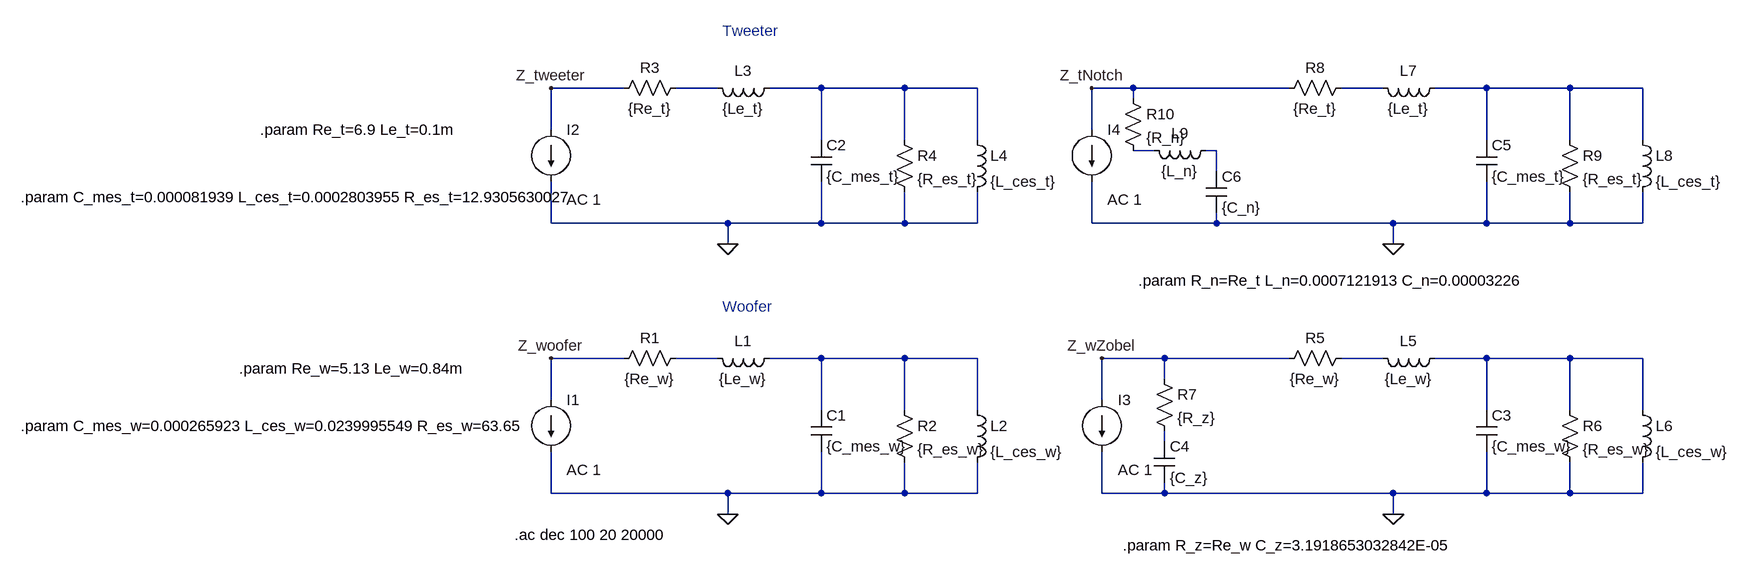
[diagram p0: schematic FreeSpace.asc]
FreeSpace.asc, the LTspice schematic file:
Version 4
SHEET 1 1732 680
WIRE 16 -288 -96 -288
WIRE 160 -288 96 -288
WIRE 320 -288 240 -288
WIRE 448 -288 320 -288
WIRE 560 -288 448 -288
WIRE 800 -288 736 -288
WIRE 1040 -288 800 -288
WIRE 1184 -288 1120 -288
WIRE 1344 -288 1264 -288
WIRE 1472 -288 1344 -288
WIRE 1584 -288 1472 -288
WIRE 800 -272 800 -288
WIRE -96 -224 -96 -288
WIRE 736 -224 736 -288
WIRE 320 -208 320 -288
WIRE 448 -208 448 -288
WIRE 560 -208 560 -288
WIRE 1344 -208 1344 -288
WIRE 1472 -208 1472 -288
WIRE 1584 -208 1584 -288
WIRE 832 -192 800 -192
WIRE 928 -192 912 -192
WIRE 928 -160 928 -192
WIRE -96 -80 -96 -144
WIRE 176 -80 -96 -80
WIRE 320 -80 320 -144
WIRE 320 -80 176 -80
WIRE 448 -80 448 -128
WIRE 448 -80 320 -80
WIRE 560 -80 560 -128
WIRE 560 -80 448 -80
WIRE 736 -80 736 -144
WIRE 928 -80 928 -96
WIRE 928 -80 736 -80
WIRE 1200 -80 928 -80
WIRE 1344 -80 1344 -144
WIRE 1344 -80 1200 -80
WIRE 1472 -80 1472 -128
WIRE 1472 -80 1344 -80
WIRE 1584 -80 1584 -128
WIRE 1584 -80 1472 -80
WIRE 176 -48 176 -80
WIRE 1200 -48 1200 -80
WIRE 16 128 -96 128
WIRE 160 128 96 128
WIRE 320 128 240 128
WIRE 448 128 320 128
WIRE 560 128 448 128
WIRE 848 128 752 128
WIRE 1040 128 848 128
WIRE 1184 128 1120 128
WIRE 1344 128 1264 128
WIRE 1472 128 1344 128
WIRE 1584 128 1472 128
WIRE 848 160 848 128
WIRE -96 192 -96 128
WIRE 752 192 752 128
WIRE 320 208 320 128
WIRE 448 208 448 128
WIRE 560 208 560 128
WIRE 1344 208 1344 128
WIRE 1472 208 1472 128
WIRE 1584 208 1584 128
WIRE 848 256 848 240
WIRE -96 336 -96 272
WIRE 176 336 -96 336
WIRE 320 336 320 272
WIRE 320 336 176 336
WIRE 448 336 448 288
WIRE 448 336 320 336
WIRE 560 336 560 288
WIRE 560 336 448 336
WIRE 752 336 752 272
WIRE 848 336 848 320
WIRE 848 336 752 336
WIRE 1200 336 848 336
WIRE 1344 336 1344 272
WIRE 1344 336 1200 336
WIRE 1472 336 1472 288
WIRE 1472 336 1344 336
WIRE 1584 336 1584 288
WIRE 1584 336 1472 336
WIRE 176 368 176 336
WIRE 1200 368 1200 336
FLAG 176 368 0
FLAG -96 128 Z_woofer
FLAG 176 -48 0
FLAG -96 -288 Z_tweeter
FLAG 1200 368 0
FLAG 752 128 Z_wZobel
FLAG 1200 -48 0
FLAG 736 -288 Z_tNotch
SYMBOL ind 256 112 R90
WINDOW 0 5 56 VBottom 2
WINDOW 3 32 56 VTop 2
SYMATTR InstName L1
SYMATTR Value {Le_w}
SYMBOL res 112 112 R90
WINDOW 0 0 56 VBottom 2
WINDOW 3 32 56 VTop 2
SYMATTR InstName R1
SYMATTR Value {Re_w}
SYMBOL current -96 192 R0
WINDOW 123 24 108 Left 2
WINDOW 39 0 0 Left 2
SYMATTR Value2 AC 1
SYMATTR InstName I1
SYMATTR Value ""
SYMBOL cap 304 208 R0
SYMATTR InstName C1
SYMATTR Value {C_mes_w}
SYMBOL res 432 192 R0
SYMATTR InstName R2
SYMATTR Value {R_es_w}
SYMBOL ind 544 192 R0
SYMATTR InstName L2
SYMATTR Value {L_ces_w}
SYMBOL ind 256 -304 R90
WINDOW 0 5 56 VBottom 2
WINDOW 3 32 56 VTop 2
SYMATTR InstName L3
SYMATTR Value {Le_t}
SYMBOL res 112 -304 R90
WINDOW 0 0 56 VBottom 2
WINDOW 3 32 56 VTop 2
SYMATTR InstName R3
SYMATTR Value {Re_t}
SYMBOL current -96 -224 R0
WINDOW 123 24 108 Left 2
WINDOW 39 0 0 Left 2
SYMATTR Value2 AC 1
SYMATTR InstName I2
SYMATTR Value ""
SYMBOL cap 304 -208 R0
SYMATTR InstName C2
SYMATTR Value {C_mes_t}
SYMBOL res 432 -224 R0
SYMATTR InstName R4
SYMATTR Value {R_es_t}
SYMBOL ind 544 -224 R0
SYMATTR InstName L4
SYMATTR Value {L_ces_t}
SYMBOL ind 1280 112 R90
WINDOW 0 5 56 VBottom 2
WINDOW 3 32 56 VTop 2
SYMATTR InstName L5
SYMATTR Value {Le_w}
SYMBOL res 1136 112 R90
WINDOW 0 0 56 VBottom 2
WINDOW 3 32 56 VTop 2
SYMATTR InstName R5
SYMATTR Value {Re_w}
SYMBOL cap 1328 208 R0
SYMATTR InstName C3
SYMATTR Value {C_mes_w}
SYMBOL res 1456 192 R0
SYMATTR InstName R6
SYMATTR Value {R_es_w}
SYMBOL ind 1568 192 R0
SYMATTR InstName L6
SYMATTR Value {L_ces_w}
SYMBOL res 832 144 R0
SYMATTR InstName R7
SYMATTR Value {R_z}
SYMBOL cap 832 256 R0
SYMATTR InstName C4
SYMATTR Value {C_z}
SYMBOL current 752 192 R0
WINDOW 123 24 108 Left 2
WINDOW 39 0 0 Left 2
SYMATTR Value2 AC 1
SYMATTR InstName I3
SYMATTR Value ""
SYMBOL ind 1280 -304 R90
WINDOW 0 5 56 VBottom 2
WINDOW 3 32 56 VTop 2
SYMATTR InstName L7
SYMATTR Value {Le_t}
SYMBOL res 1136 -304 R90
WINDOW 0 0 56 VBottom 2
WINDOW 3 32 56 VTop 2
SYMATTR InstName R8
SYMATTR Value {Re_t}
SYMBOL cap 1328 -208 R0
SYMATTR InstName C5
SYMATTR Value {C_mes_t}
SYMBOL res 1456 -224 R0
SYMATTR InstName R9
SYMATTR Value {R_es_t}
SYMBOL ind 1568 -224 R0
SYMATTR InstName L8
SYMATTR Value {L_ces_t}
SYMBOL res 784 -288 R0
SYMATTR InstName R10
SYMATTR Value {R_n}
SYMBOL ind 928 -208 R90
WINDOW 0 5 56 VBottom 2
WINDOW 3 32 56 VTop 2
SYMATTR InstName L9
SYMATTR Value {L_n}
SYMBOL cap 912 -160 R0
SYMATTR InstName C6
SYMATTR Value {C_n}
SYMBOL current 736 -224 R0
WINDOW 123 24 108 Left 2
WINDOW 39 0 0 Left 2
SYMATTR Value2 AC 1
SYMATTR InstName I4
SYMATTR Value ""
TEXT -152 400 Left 2 !.ac dec 100 20 20000
TEXT -576 144 Left 2 !.param Re_w=5.13 Le_w=0.84m
TEXT -912 232 Left 2 !.param C_mes_w=0.000265923 L_ces_w=0.0239995549 R_es_w=63.65
TEXT -544 -224 Left 2 !.param Re_t=6.9 Le_t=0.1m
TEXT -912 -120 Left 2 !.param C_mes_t=0.000081939 L_ces_t=0.0002803955 R_es_t=12.9305630027
TEXT 168 -376 Left 2 ;Tweeter
TEXT 168 48 Left 2 ;Woofer
TEXT 784 416 Left 2 !.param R_z=Re_w C_z=3.1918653032842E-05
TEXT 808 8 Left 2 !.param R_n=Re_t L_n=0.0007121913 C_n=0.00003226

The netlist it stands for:
* FreeSpace.asc
L1 N008 N007 {Le_w}
R1 N007 Z_woofer {Re_w}
I1 Z_woofer 0 AC 1
C1 N008 0 {C_mes_w}
R2 N008 0 {R_es_w}
L2 N008 0 {L_ces_w}
L3 N002 N001 {Le_t}
R3 N001 Z_tweeter {Re_t}
I2 Z_tweeter 0 AC 1
C2 N002 0 {C_mes_t}
R4 N002 0 {R_es_t}
L4 N002 0 {L_ces_t}
L5 N010 N009 {Le_w}
R5 N009 Z_wZobel {Re_w}
C3 N010 0 {C_mes_w}
R6 N010 0 {R_es_w}
L6 N010 0 {L_ces_w}
R7 Z_wZobel N011 {R_z}
C4 N011 0 {C_z}
I3 Z_wZobel 0 AC 1
L7 N004 N003 {Le_t}
R8 N003 Z_tNotch {Re_t}
C5 N004 0 {C_mes_t}
R9 N004 0 {R_es_t}
L8 N004 0 {L_ces_t}
R10 Z_tNotch N005 {R_n}
L9 N006 N005 {L_n}
C6 N006 0 {C_n}
I4 Z_tNotch 0 AC 1
.ac dec 100 20 20000
.param Re_w=5.13 Le_w=0.84m
.param C_mes_w=0.000265923 L_ces_w=0.0239995549 R_es_w=63.65
.param Re_t=6.9 Le_t=0.1m
.param C_mes_t=0.000081939 L_ces_t=0.0002803955 R_es_t=12.9305630027
* Tweeter
* Woofer
.param R_z=Re_w C_z=3.1918653032842E-05
.param R_n=Re_t L_n=0.0007121913 C_n=0.00003226
.backanno
.end

* Results of the author's LTspice run, read from the files saved beside the schematic
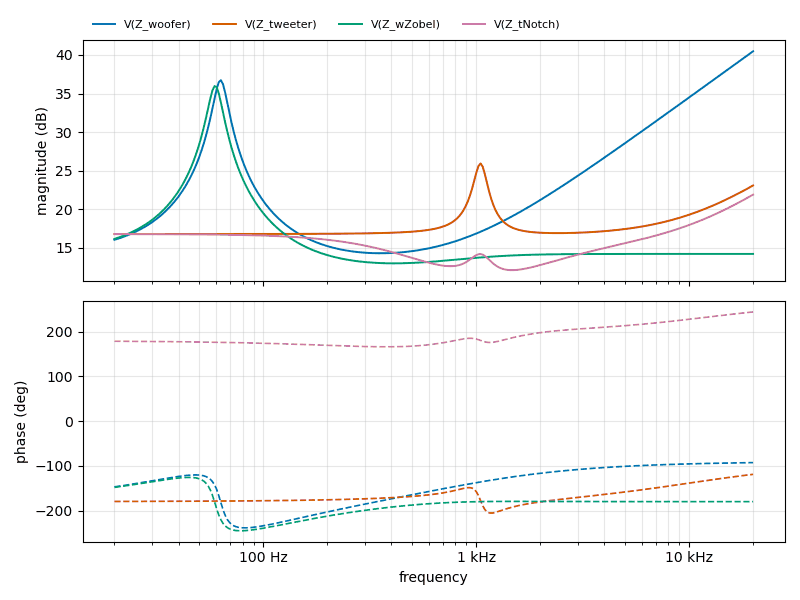
[diagram p1: AC Analysis of FreeSpace.asc, plotted from the saved traces]
* AC Analysis, 1 run:
*   V(Z_woofer): 16.03 dB at 20 Hz, 40.48 dB at 20 kHz, peak 40.48 dB at 20 kHz, 3 dB below the peak at 14.13 kHz
*   V(Z_tweeter): 16.78 dB at 20 Hz, 23.08 dB at 20 kHz, peak 25.93 dB at 1.05 kHz, 3 dB below the peak at 962.9 Hz and 1.136 kHz
*   V(Z_wZobel): 16.14 dB at 20 Hz, 14.20 dB at 20 kHz, peak 35.96 dB at 59.02 Hz, 3 dB below the peak at 54.95 Hz and 64.26 Hz
*   V(Z_tNotch): 16.77 dB at 20 Hz, 21.89 dB at 20 kHz, peak 21.89 dB at 20 kHz, 3 dB below the peak at 12.15 kHz